# Altium schematic sheet SCH-1-ESD Power Rails.SchDoc
size Letter
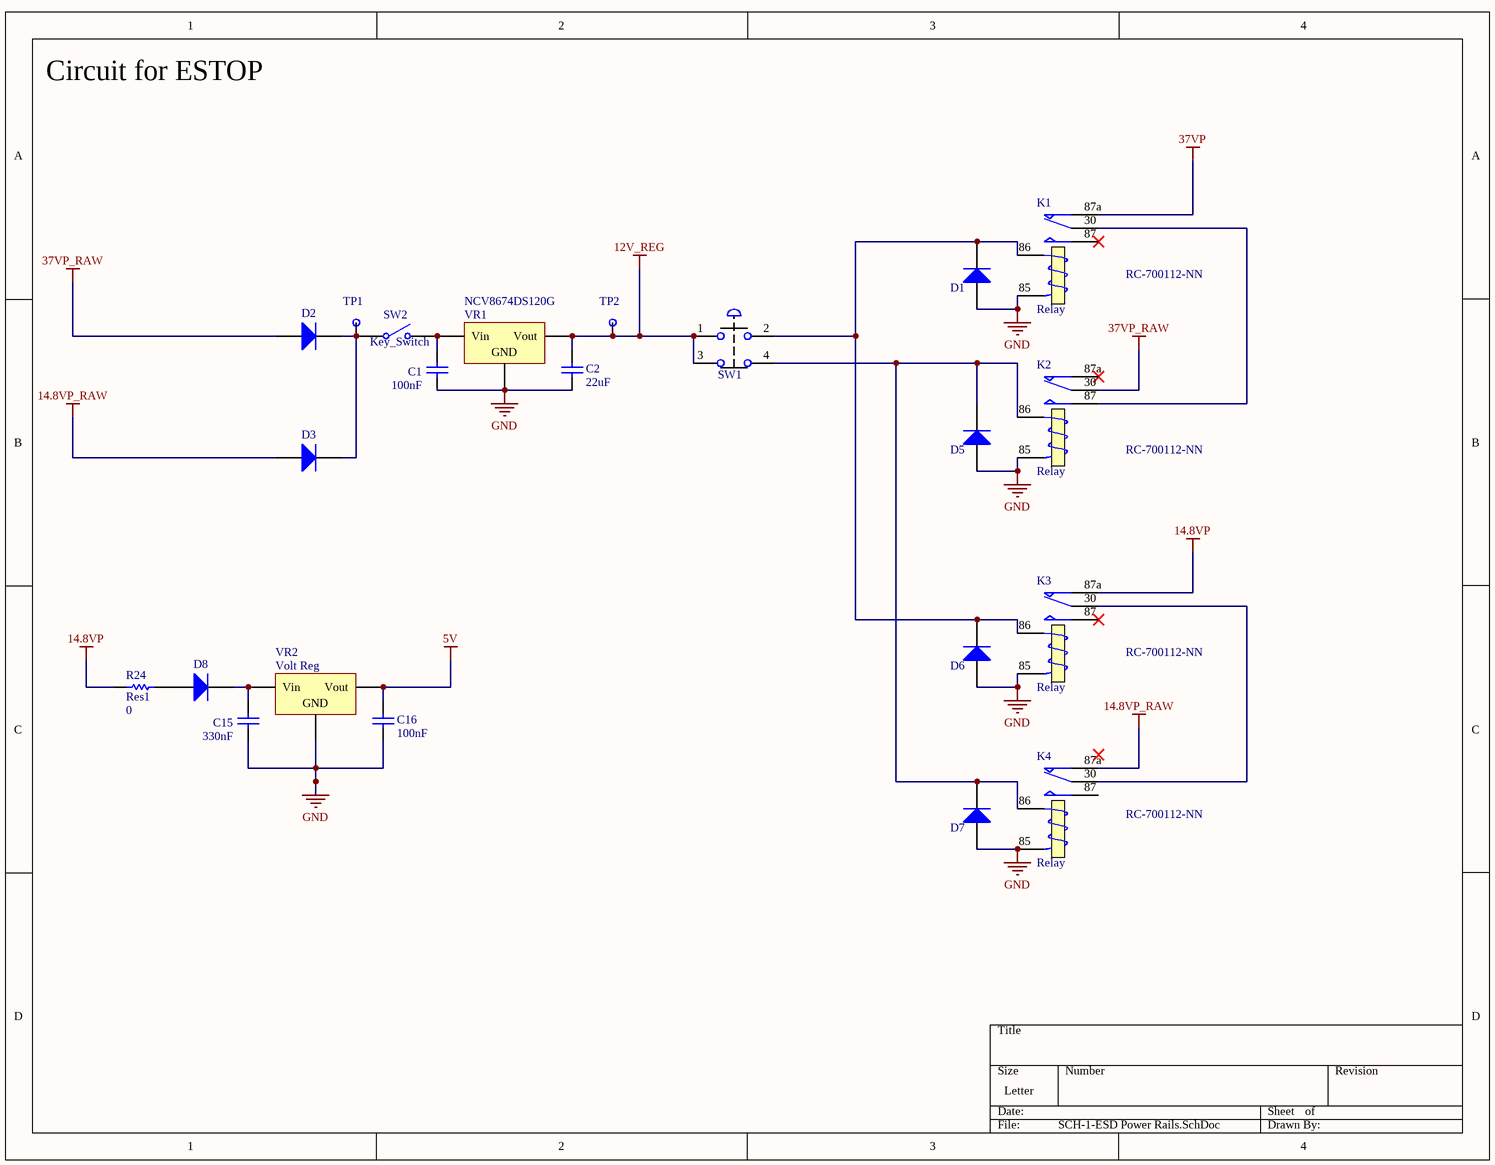
[diagram p0: SCH-1-ESD Power Rails.SchDoc]

## Parts
C1  value 100nF  [1608[0603]]  (hidden comment: Cap)
C2  value 22uF  [1608[0603]]  (hidden comment: Cap)
C15  value 330nF  [1608[0603]]  (hidden comment: Cap)
C16  value 100nF  [1608[0603]]  (hidden comment: Cap)
D1  Diode 1N4001  [DO-41]  (value not drawn)
D2  Diode 1N4001  [DO-41]  (value not drawn)
D3  Diode 1N4001  [DO-41]  (value not drawn)
D5  Diode 1N4001  [DO-41]  (value not drawn)
D6  Diode 1N4001  [DO-41]  (value not drawn)
D7  Diode 1N4001  [DO-41]  (value not drawn)
D8  Diode 1N4001  [DO-41]  (value not drawn)
K1  Relay  [Relay RC-700112-NN]
K2  Relay  [Relay RC-700112-NN]
K3  Relay  [Relay RC-700112-NN]
K4  Relay  [Relay RC-700112-NN]
R24  Res1  value 0  [AXIAL-0.3]
SW1  NO-NC ESD with light  [MOLEX 0039281043]  (value not drawn)
SW2  Key_Switch  [MOLEX_0039293026]
TP1  TestPt  [50_MIL_PAD]  (value not drawn)
TP2  TestPt  [50_MIL_PAD]  (value not drawn)
VR1  Volt Reg  [DPAK254P1420X457-3N]  (value not drawn)
VR2  Volt Reg  [D2PAK_N]

## Nets
5V: C16.1 VR2.3(Vout)
12V_REG: C2.1 SW1.1 SW1.3 TP2.1 VR1.3(Vout)
14.8VP: K3.87a(NC) R24.1
14.8VP_RAW: D3.1(A) K4.87a(NC)
37VP: K1.87a(NC)
37VP_RAW: D2.1(A) K2.30(COM)
GND: C1.2 C2.2 C15.2 C16.2 D1.1(A) D5.1(A) D6.1(A) D7.1(A) K1.85(T2) K2.85(T2) K3.85(T2) K4.85(T2) VR1.2(GND) VR2.2(GND)
NetC1_1: C1.1 SW2.2(NO) VR1.1(Vin)
NetC15_1: C15.1 D8.2(K) VR2.1(Vin)
NetD1_2: D1.2(K) D6.2(K) K1.86(T1) K3.86(T1) SW1.2
NetD2_2: D2.2(K) D3.2(K) SW2.1(COMMON) TP1.1
NetD5_2: D5.2(K) D7.2(K) K2.86(T1) K4.86(T1) SW1.4
NetD8_1: D8.1(A) R24.2
NetK1_30: K1.30(COM) K2.87(NO)
NetK3_30: K3.30(COM) K4.30(COM)

Not connected (* = marked no-connect by the designer): K1 87(NO)*; K2 87a(NC)*; K3 87(NO)*; K4 87(NO)

## Notes on the sheet
- Circuit for ESTOP
- (near VR1) NCV8674DS120G
- RC-700112-NN

## Library data of the parts
C1 C2 C15 C16 = Cap: Capacitor; Published: 8-Jun-2000; LatestRevisionDate: 17-Jul-2002; LatestRevisionNote: Re-released for DXP Platform.; PackageReference: RAD-0.3; Publisher: Altium Limited; PackageDescription: Radial Cap, Thru-Hole; 2 Leads; 0.3 in Pin Spacing
D1-D3 D5-D8 = Diode 1N4001: 1 Amp General Purpose Rectifier; Published: 8-Jun-2000; LatestRevisionDate: 17-Jul-2002; LatestRevisionNote: Re-released for DXP Platform.; DatasheetVersion: 1998; PackageVersion: Aug-1999; PackageReference: DO-41; Publisher: Altium Limited; PackageDescription: Diode, Axial; Body 5.2 x 2.7 mm (LxDia. max), Lead Dia. 0.86 mm (max); Code_JEDEC: DO-204-AL; ComponentLink1Description: Manufacturer Link; ComponentLink1URL: http://www.fairchildsemi.com/; ComponentLink2Description: Datasheet; ComponentLink2URL: http://www.fairchildsemi.com/ds/1N%2F1N4001.pdf
K1-K4 = Relay: SPDT Relay; Published: 8-Jun-2000; LatestRevisionDate: 17-Jul-2002; LatestRevisionNote: Re-released for DXP Platform.; PackageReference: MODULE5B; Publisher: Altium Limited
R24 = Res1: Resistor; Published: 8-Jun-2000; LatestRevisionDate: 17-Jul-2002; LatestRevisionNote: Re-released for DXP Platform.; PackageReference: AXIAL-0.3; Publisher: Altium Limited; PackageDescription: Axial Device, Thru-Hole; 2 Leads; 0.3 in Pin Spacing
SW1 = DPST ESTOP
VR1 VR2 = Volt Reg: Voltage Regulator; Published: 24-Mar-1999; LatestRevisionDate: 29-May-2009; LatestRevisionNote: IPC-7351 Footprint Added.; PackageReference: D2PAK; Publisher: Altium Limited; PackageDescription: 3-Pin Transistor Outline Package 2.54 mm Pitch, 15.1 mm Lead Span
SW2 = Key_Switch: Published: 24-Mar-1999; LatestRevisionDate: 17-Jul-2002; LatestRevisionNote: Re-released for DXP Platform.; PackageReference: SPST-2; Publisher: Altium Limited; PackageDescription: Switch; 2 Leads